# EAGLE design 433_DigiSpark (EAGLE 6.5.0)
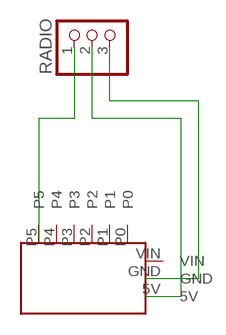
[diagram p0: schematic, sheet 1]

## Parts
DIGISPARK  DIGISPARK  [DIGISPARK]
RADIO  PINHD-1X3  [1X03]

## Nets
N$1: DIGISPARK.P5 RADIO.1
N$4: DIGISPARK.GND RADIO.3
N$6: DIGISPARK.5V RADIO.2
Unconnected: DIGISPARK.P0 DIGISPARK.P1 DIGISPARK.P2 DIGISPARK.P3 DIGISPARK.P4

## Power pins joined to a net without a drawn wire
VIN: DIGISPARK.VIN

## Library data of the parts
DIGISPARK = Franc:DIGISPARK
RADIO = pinhead:PINHD-1X3: PIN HEADER

## Board
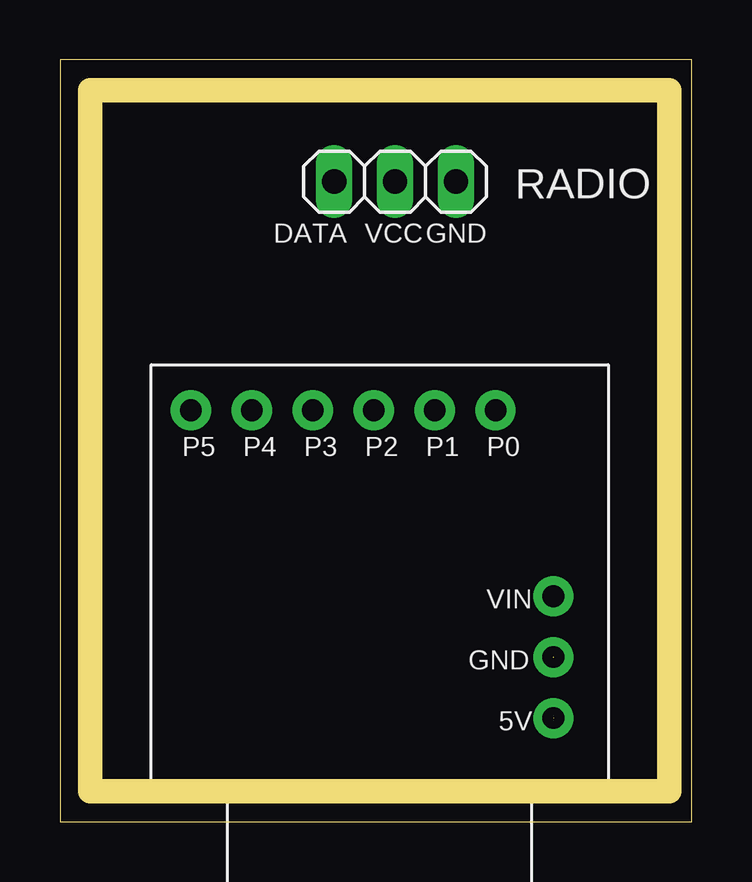
[diagram p1: board, top side]
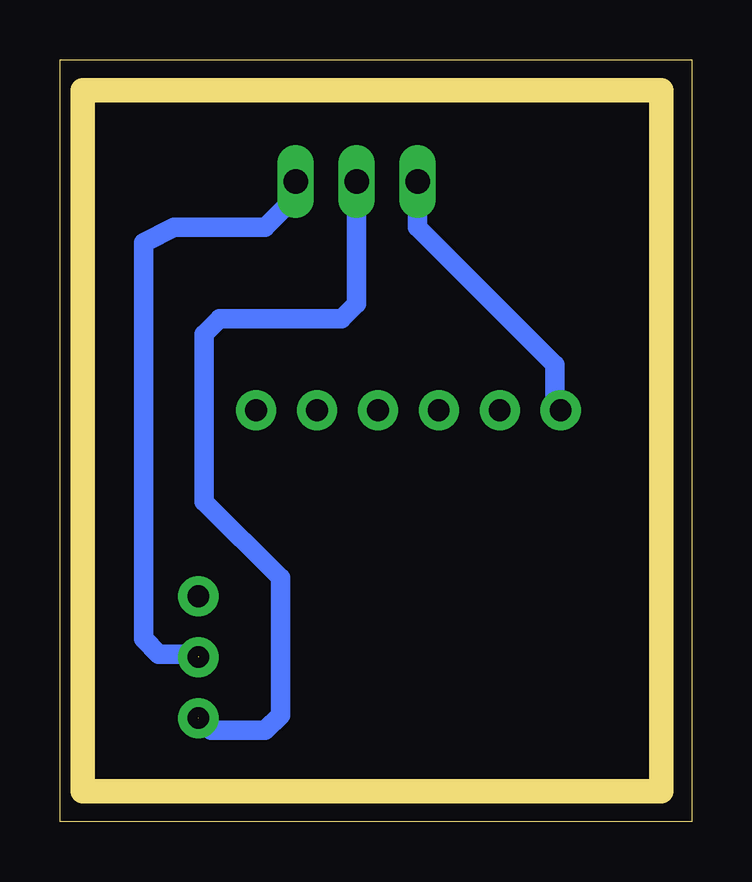
[diagram p2: board, bottom side, seen from below]

Size 26.34 x 31.74 mm. Coordinates in mm from the lower left corner, seen from the top.
Outline: 0,0 26.34,0 26.34,31.74 0,31.74 0,0
Copper layers (1*16): Top 0.035mm / dielectric 1.5mm / Bottom 0.035mm
Design rules "default": minimum track width 10mil, minimum drill 24mil, track to track 8mil, track to pad 8mil, pad to pad 8mil, via to via 8mil, smd to smd 8mil, copper to edge 40mil, drill to drill 8mil, minimum pad ring 10mil, minimum via ring 8mil, stop-mask expansion 4mil, vias tented up to drill 0mil, thermal gap 10mil
Milling: 4 lines

### Footprints (pad centres in the part's own frame; a part is rotated, then mirrored left to right if it is on the bottom)
DIGISPARK = drill 0.9 pad 1.676: 5V 16.764,10.668; GND 16.764,13.208; P0 14.351,23.495; P1 11.811,23.495; P2 9.271,23.495; P3 6.731,23.495; P4 4.191,23.495; P5 1.651,23.495; VIN 16.764,15.748
1X03 = drill 1.016 long: 1 -2.54,0; 2 0,0; 3 2.54,0

### Placement (x,y rotation side)
DIGISPARK  3.81,-6.35 0 top
RADIO  13.97,26.67 0 top

### Tracks (layer width: path | path; a pad name or v marks a point on that pad's centre or on a via)
N$1
  Bottom 0.813: RADIO.1 11.43,24.77 5.71,19.05 5.71,17.4 DIGISPARK.P5
N$4  (1 unrouted)
  Bottom 0.813: RADIO.3 16.51,26.04 17.78,24.77 21.59,24.77 22.86,24.13 22.86,7.62 22.23,6.99 20.65,6.99 20.55,6.88
N$6  (1 unrouted)
  Bottom 0.813: RADIO.2 13.97,21.59 14.61,20.95 19.68,20.95 20.32,20.32 20.32,13.34 17.14,10.16 17.14,4.45 17.78,3.81 20.04,3.81 20.57,4.34

### Text on the board
tNames: DATA | VCC | GND